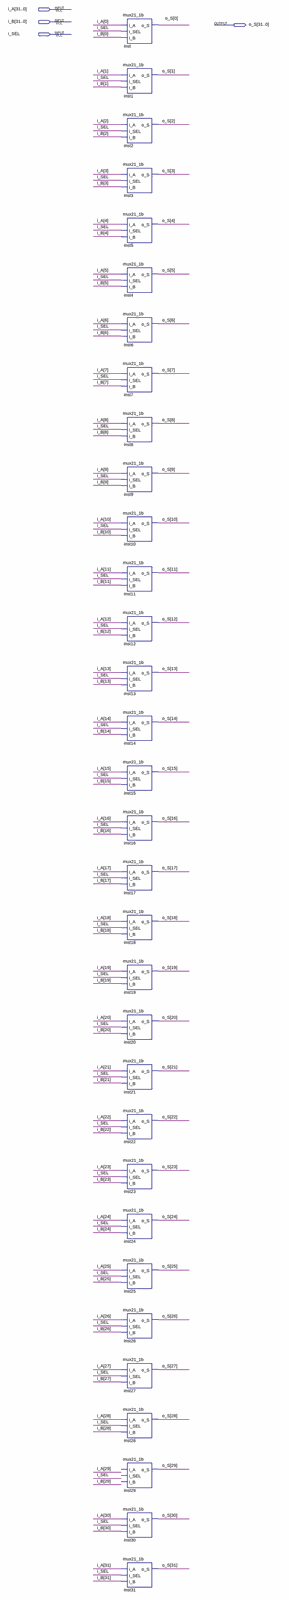
[diagram p0: schematic sheet, whole]
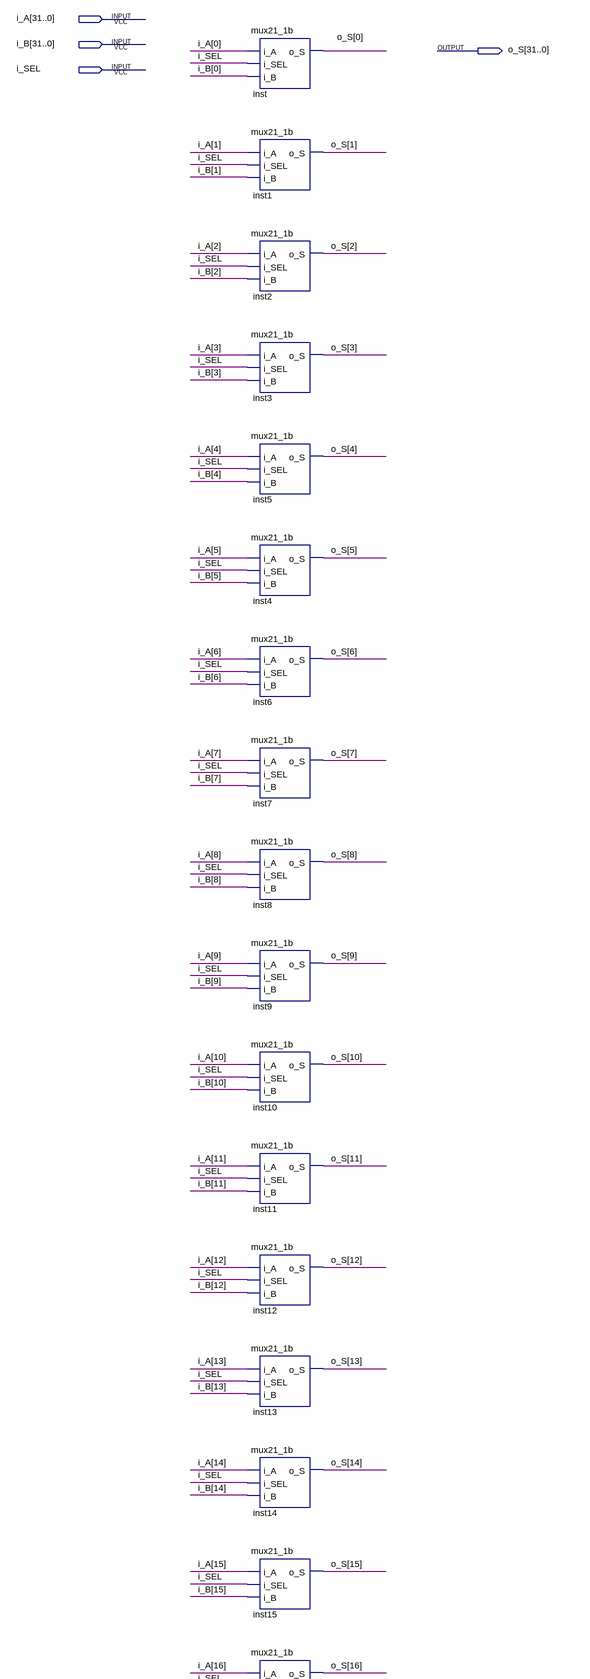
[diagram p1: schematic sheet, upper part]
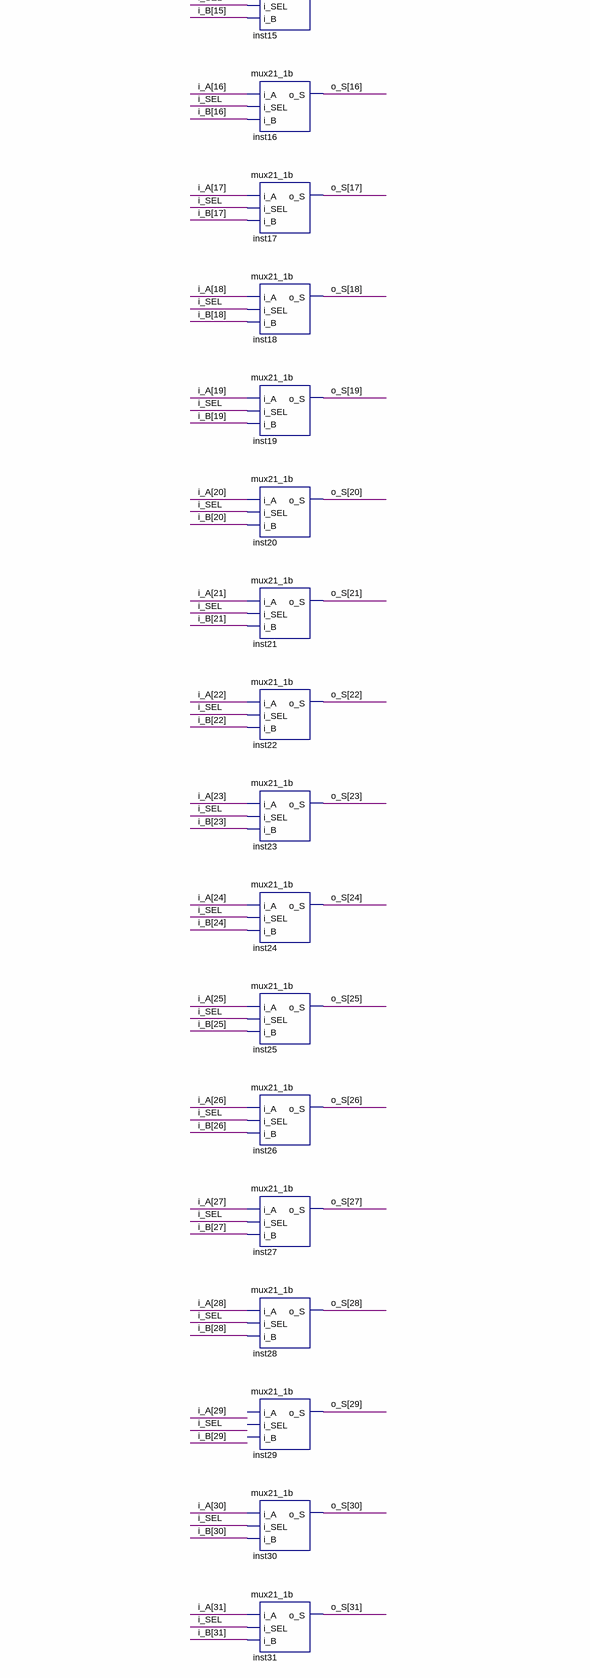
[diagram p2: schematic sheet, lower part]
// Quartus schematic mux21_32b.bdf as structural Verilog: 32 symbols, 4 pins
module mux21_32b (
  input  [31:0] i_A,
  input  [31:0] i_B,
  input  i_SEL,
  output [31:0] o_S
);

  mux21_1b inst (.i_A(i_A[0]), .i_SEL(i_SEL), .i_B(i_B[0]), .o_S(o_S[0]));
  mux21_1b inst1 (.i_A(i_A[1]), .i_SEL(i_SEL), .i_B(i_B[1]), .o_S(o_S[1]));
  mux21_1b inst2 (.i_A(i_A[2]), .i_SEL(i_SEL), .i_B(i_B[2]), .o_S(o_S[2]));
  mux21_1b inst3 (.i_A(i_A[3]), .i_SEL(i_SEL), .i_B(i_B[3]), .o_S(o_S[3]));
  mux21_1b inst5 (.i_A(i_A[4]), .i_SEL(i_SEL), .i_B(i_B[4]), .o_S(o_S[4]));
  mux21_1b inst4 (.i_A(i_A[5]), .i_SEL(i_SEL), .i_B(i_B[5]), .o_S(o_S[5]));
  mux21_1b inst6 (.i_A(i_A[6]), .i_SEL(i_SEL), .i_B(i_B[6]), .o_S(o_S[6]));
  mux21_1b inst7 (.i_A(i_A[7]), .i_SEL(i_SEL), .i_B(i_B[7]), .o_S(o_S[7]));
  mux21_1b inst8 (.i_A(i_A[8]), .i_SEL(i_SEL), .i_B(i_B[8]), .o_S(o_S[8]));
  mux21_1b inst9 (.i_A(i_A[9]), .i_SEL(i_SEL), .i_B(i_B[9]), .o_S(o_S[9]));
  mux21_1b inst10 (.i_A(i_A[10]), .i_SEL(i_SEL), .i_B(i_B[10]), .o_S(o_S[10]));
  mux21_1b inst11 (.i_A(i_A[11]), .i_SEL(i_SEL), .i_B(i_B[11]), .o_S(o_S[11]));
  mux21_1b inst12 (.i_A(i_A[12]), .i_SEL(i_SEL), .i_B(i_B[12]), .o_S(o_S[12]));
  mux21_1b inst13 (.i_A(i_A[13]), .i_SEL(i_SEL), .i_B(i_B[13]), .o_S(o_S[13]));
  mux21_1b inst14 (.i_A(i_A[14]), .i_SEL(i_SEL), .i_B(i_B[14]), .o_S(o_S[14]));
  mux21_1b inst15 (.i_A(i_A[15]), .i_SEL(i_SEL), .i_B(i_B[15]), .o_S(o_S[15]));
  mux21_1b inst16 (.i_A(i_A[16]), .i_SEL(i_SEL), .i_B(i_B[16]), .o_S(o_S[16]));
  mux21_1b inst17 (.i_A(i_A[17]), .i_SEL(i_SEL), .i_B(i_B[17]), .o_S(o_S[17]));
  mux21_1b inst18 (.i_A(i_A[18]), .i_SEL(i_SEL), .i_B(i_B[18]), .o_S(o_S[18]));
  mux21_1b inst19 (.i_A(i_A[19]), .i_SEL(i_SEL), .i_B(i_B[19]), .o_S(o_S[19]));
  mux21_1b inst20 (.i_A(i_A[20]), .i_SEL(i_SEL), .i_B(i_B[20]), .o_S(o_S[20]));
  mux21_1b inst21 (.i_A(i_A[21]), .i_SEL(i_SEL), .i_B(i_B[21]), .o_S(o_S[21]));
  mux21_1b inst22 (.i_A(i_A[22]), .i_SEL(i_SEL), .i_B(i_B[22]), .o_S(o_S[22]));
  mux21_1b inst23 (.i_A(i_A[23]), .i_SEL(i_SEL), .i_B(i_B[23]), .o_S(o_S[23]));
  mux21_1b inst24 (.i_A(i_A[24]), .i_SEL(i_SEL), .i_B(i_B[24]), .o_S(o_S[24]));
  mux21_1b inst25 (.i_A(i_A[25]), .i_SEL(i_SEL), .i_B(i_B[25]), .o_S(o_S[25]));
  mux21_1b inst26 (.i_A(i_A[26]), .i_SEL(i_SEL), .i_B(i_B[26]), .o_S(o_S[26]));
  mux21_1b inst27 (.i_A(i_A[27]), .i_SEL(i_SEL), .i_B(i_B[27]), .o_S(o_S[27]));
  mux21_1b inst28 (.i_A(i_A[28]), .i_SEL(i_SEL), .i_B(i_B[28]), .o_S(o_S[28]));
  mux21_1b inst29 (.o_S(o_S[29]));  // open: i_A, i_SEL, i_B
  mux21_1b inst30 (.i_A(i_A[30]), .i_SEL(i_SEL), .i_B(i_B[30]), .o_S(o_S[30]));
  mux21_1b inst31 (.i_A(i_A[31]), .i_SEL(i_SEL), .i_B(i_B[31]), .o_S(o_S[31]));
endmodule
